# Altium schematic sheet LAB3-1.SchDoc
size A; SheetNumber: 1; SheetTotal: 1
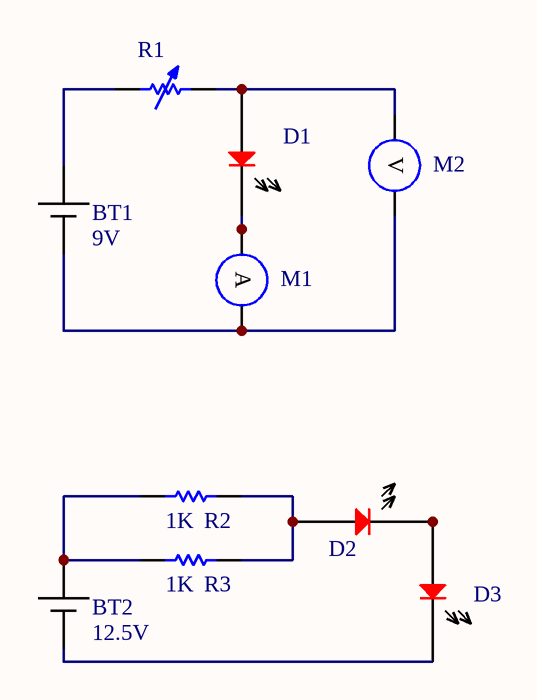
[diagram p0: LAB3-1.SchDoc]

## Parts
BT1  9V
BT2  12.5V
D1  LED RED  [150060SS75000]  (value not drawn)
D2  LED RED  [150060SS75000]  (value not drawn)
D3  LED RED  [150060SS75000]  (value not drawn)
M1  ?*  (value not drawn)
M2  GENERIC - VOLTMETER  (value not drawn)
R1  Res Adj1  [AXIAL-0.7]  (value not drawn)
R2  value 1K  [AXIAL-0.3]  (hidden comment: Res1)
R3  value 1K  [AXIAL-0.3]  (hidden comment: Res1)

## Nets
NetBT1_1: BT1.1(-) M1.2 M2.2
NetBT1_2: BT1.2(+) R1.1
NetBT2_1: BT2.1(-) D3.2(RED_-)
NetBT2_2: BT2.2(+) R2.1 R3.1
NetD1_1: D1.1(Red_+) M2.1 R1.2
NetD1_2: D1.2(RED_-) M1.1
NetD2_1: D2.1(Red_+) R2.2 R3.2
NetD2_2: D2.2(RED_-) D3.1(Red_+)

## Notes on the sheet
- (in symbol GENERIC - AMMETER) A
- (in symbol GENERIC - VOLTMETER) V

## Library data of the parts
BT1 BT2 = GENERIC - 1 CELL BATTERY: Generic 1-Cell Power Supply
D1-D3 = LED RED: Single Color LED, Super Red, Water Clear, 1.1mm; Manufacturer: Wurth Electronics; Shape: Rectangular; Number of Functions: 1; Forward Current-Max: 30mA; Luminous Intensity-Nom: 60mcd; Viewing Angle: 140°; Overall Height: 0.7mm; Supplier 1: Digi-Key; RoHS: Yes; Category: LEDs; Stock 1: 10507; Pricing 1: 1=0.14000, 50=0.13300, 100=0.11400, 500=0.09990 (USD); Mount: Surface Mount; Number of Pins: 2; Color: Red; Min Operating Temperature: -40°C; Max Operating Temperature: 85°C; Lens Style: WATER CLEAR; Optoelectronic Device Type: SINGLE COLOR LED; Packaging: Tape and Reel; Terminal Pitch: 1.6mm; Size: 1.1mm; REACH SVHC: Yes; RoHS Compliant: Yes; ComponentLink1URL: https://datasheet.ciiva.com:443/pdfs/VipMasterIC/IC/MIDC/MIDC-S-A0007768811/MIDC-S-A0007768811-1.pdf?src-supplier=IHS+Markit; ComponentLink1Description: https://datasheet.ciiva.com:443/pdfs/VipMasterIC/IC/MIDC/MIDC-S-A0007768811/MIDC-S-A0007768811-1.pdf?src-supplier=IHS+Markit; ComponentLink2URL: https://datasheet.ciiva.com/23843/150060ss75000-23843248.pdf?src-supplier=Newark; ComponentLink2Description: https://datasheet.ciiva.com/23843/150060ss75000-23843248.pdf?src-supplier=Newark; ComponentLink3URL: https://datasheet.ciiva.com/29279/759429-da-01-en-chipled-0603-w-kl-s-rot-150060ss75000-29279208.pdf?src-supplier=Conrad; ComponentLink3Description: https://datasheet.ciiva.com/29279/759429-da-01-en-chipled-0603-w-kl-s-rot-150060ss75000-29279208.pdf?src-supplier=Conrad; ComponentLink4URL: https://datasheet.ciiva.com/48430/150060ss75000-eng-tds-48430042.pdf?src-supplier=Distrelec; ComponentLink4Description: https://datasheet.ciiva.com/48430/150060ss75000-eng-tds-48430042.pdf?src-supplier=Distrelec; Supplier Part Number 1: 732-4979-1-ND; Manufacturer Part Number: 150060SS75000
M1 = GENERIC - AMMETER: Generic Ammeter
M2 = GENERIC - VOLTMETER: Generic Voltmeter
R1 = Res Adj1: Variable Resistor; Value: 10K; Set Position: 0.5; Published: 8-Jun-2000; LatestRevisionDate: 17-Jul-2002; LatestRevisionNote: Re-released for DXP Platform.; PackageReference: AXIAL-0.7; Publisher: Altium Limited; PackageDescription: Axial Device, Thru-Hole; 2 Leads; 0.7 in Pin Spacing
R2 R3 = Res1: Resistor; Published: 8-Jun-2000; LatestRevisionDate: 17-Jul-2002; LatestRevisionNote: Re-released for DXP Platform.; PackageReference: AXIAL-0.3; Publisher: Altium Limited; PackageDescription: Axial Device, Thru-Hole; 2 Leads; 0.3 in Pin Spacing